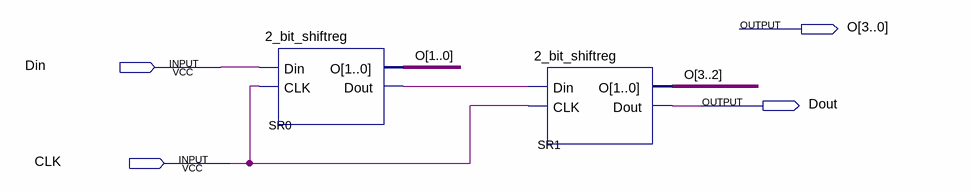
[diagram p0: schematic sheet]
// Quartus schematic 4_bit_shiftreg.bdf as structural Verilog: 2 symbols, 4 pins
module \4_bit_shiftreg  (
  input  Din,
  input  CLK,
  output [3:0] O,
  output Dout
);

  wire SR0_dout;

  \2_bit_shiftreg  SR0 (.Din(Din), .CLK(CLK), .O(O[1:0]), .Dout(SR0_dout));
  \2_bit_shiftreg  SR1 (.Din(SR0_dout), .CLK(CLK), .O(O[3:2]), .Dout(Dout));
endmodule
